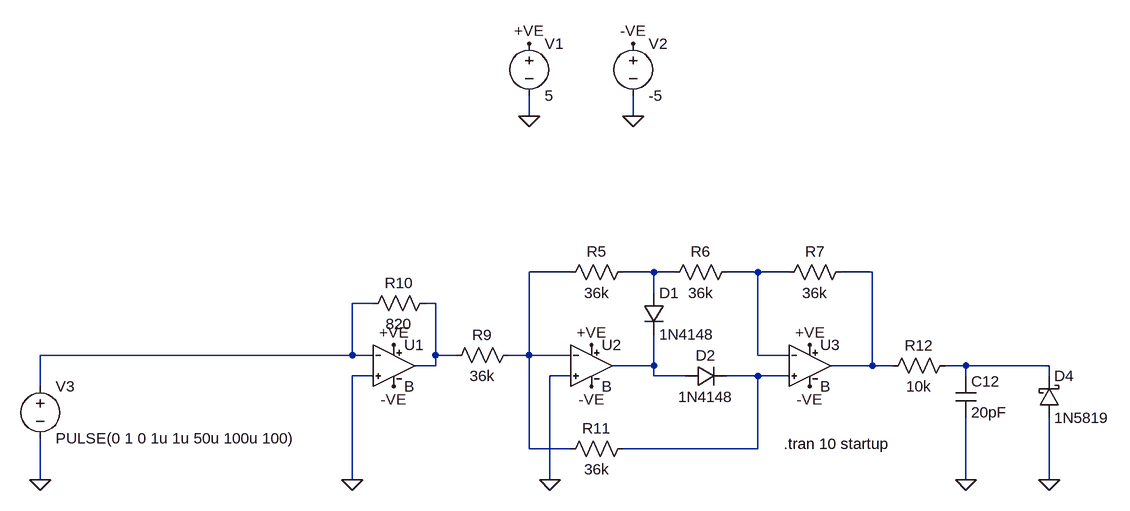
[diagram p0: schematic DFR0300 (V1.0) Test.asc]
DFR0300 (V1.0) Test.asc, the LTspice schematic file:
Version 4
SHEET 1 880 680
WIRE -384 80 -384 48
WIRE -224 80 -224 48
WIRE -320 320 -384 320
WIRE -192 320 -240 320
WIRE -160 320 -192 320
WIRE -32 320 -80 320
WIRE 16 320 -32 320
WIRE 144 320 96 320
WIRE -192 352 -192 320
WIRE -624 368 -656 368
WIRE -528 368 -544 368
WIRE -656 448 -656 368
WIRE -656 448 -1136 448
WIRE -624 448 -656 448
WIRE -528 448 -528 368
WIRE -496 448 -528 448
WIRE -384 448 -384 320
WIRE -384 448 -416 448
WIRE -320 448 -384 448
WIRE -32 448 -32 320
WIRE 16 448 -32 448
WIRE -528 464 -528 448
WIRE -528 464 -560 464
WIRE -192 464 -192 416
WIRE -192 464 -256 464
WIRE 144 464 144 320
WIRE 144 464 80 464
WIRE 176 464 144 464
WIRE 288 464 256 464
WIRE 416 464 288 464
WIRE -624 480 -656 480
WIRE -320 480 -352 480
WIRE -192 480 -192 464
WIRE -144 480 -192 480
WIRE -32 480 -80 480
WIRE 16 480 -32 480
WIRE 288 480 288 464
WIRE 416 480 416 464
WIRE -1136 496 -1136 448
WIRE -384 592 -384 448
WIRE -320 592 -384 592
WIRE -32 592 -32 480
WIRE -32 592 -240 592
WIRE -1136 640 -1136 576
WIRE -656 640 -656 480
WIRE -352 640 -352 480
WIRE 288 640 288 544
WIRE 416 640 416 544
FLAG 416 640 0
FLAG 288 640 0
FLAG -352 640 0
FLAG -656 640 0
FLAG -384 80 0
FLAG -224 80 0
FLAG -384 -32 +VE
FLAG -224 -32 -VE
FLAG -592 432 +VE
FLAG -288 432 +VE
FLAG 48 432 +VE
FLAG -592 496 -VE
FLAG -288 496 -VE
FLAG 48 496 -VE
FLAG -1136 640 0
SYMBOL schottky 400 544 M180
WINDOW 0 24 64 Left 2
WINDOW 3 24 0 Left 2
SYMATTR InstName D4
SYMATTR Value 1N5819
SYMATTR Description Diode
SYMATTR Type diode
SYMBOL Res 272 448 R90
WINDOW 0 0 56 VBottom 2
WINDOW 3 32 56 VTop 2
SYMATTR InstName R12
SYMATTR Value 10k
SYMBOL Cap 272 480 R0
SYMATTR InstName C12
SYMATTR Value 20pF
SYMBOL Res 112 304 R90
WINDOW 0 0 56 VBottom 2
WINDOW 3 32 56 VTop 2
SYMATTR InstName R7
SYMATTR Value 36k
SYMBOL diode -144 496 R270
WINDOW 0 32 32 VTop 2
WINDOW 3 0 32 VBottom 2
SYMATTR InstName D2
SYMATTR Value 1N4148
SYMBOL diode -208 352 R0
SYMATTR InstName D1
SYMATTR Value 1N4148
SYMBOL Res -64 304 R90
WINDOW 0 0 56 VBottom 2
WINDOW 3 32 56 VTop 2
SYMATTR InstName R6
SYMATTR Value 36k
SYMBOL Res -224 304 R90
WINDOW 0 0 56 VBottom 2
WINDOW 3 32 56 VTop 2
SYMATTR InstName R5
SYMATTR Value 36k
SYMBOL Res -224 576 R90
WINDOW 0 0 56 VBottom 2
WINDOW 3 32 56 VTop 2
SYMATTR InstName R11
SYMATTR Value 36k
SYMBOL Res -400 432 R90
WINDOW 0 0 56 VBottom 2
WINDOW 3 32 56 VTop 2
SYMATTR InstName R9
SYMATTR Value 36k
SYMBOL Res -528 352 R90
WINDOW 0 0 56 VBottom 2
WINDOW 3 32 56 VTop 2
SYMATTR InstName R10
SYMATTR Value 820
SYMBOL voltage -384 -48 R0
WINDOW 123 0 0 Left 0
WINDOW 39 0 0 Left 0
SYMATTR InstName V1
SYMATTR Value 5
SYMBOL voltage -224 -48 R0
WINDOW 123 0 0 Left 0
WINDOW 39 0 0 Left 0
SYMATTR InstName V2
SYMATTR Value -5
SYMBOL voltage -1136 480 R0
WINDOW 123 0 0 Left 0
WINDOW 39 0 0 Left 0
SYMATTR InstName V3
SYMATTR Value PULSE(0 1 0 1u 1u 50u 100u 100)
SYMBOL TL034 -592 400 R0
SYMATTR InstName U1
SYMATTR Value B
SYMATTR SpiceModel TL034.mod
SYMBOL TL034 -288 400 R0
SYMATTR InstName U2
SYMATTR Value B
SYMATTR SpiceModel TL034.mod
SYMBOL TL034 48 400 R0
SYMATTR InstName U3
SYMATTR Value B
SYMATTR SpiceModel TL034.mod
TEXT 8 584 Left 2 !.tran 10 startup

The netlist it stands for:
* DFR0300 (V1.0) Test.asc
D4 0 N008 1N5819
R12 N008 N004 10k
C12 N008 0 20pF
R7 N004 N003 36k
D2 N007 N009 1N4148
D1 N002 N007 1N4148
R6 N003 N002 36k
R5 N002 N001 36k
R11 N009 N001 36k
R9 N001 N006 36k
R10 N006 N005 820
V1 +VE 0 5
V2 -VE 0 -5
V3 N005 0 PULSE(0 1 0 1u 1u 50u 100u 100)
XU1 0 N005 +VE -VE N006 B  ; pins In+ In- V+ V- OUT
XU2 0 N001 +VE -VE N007 B  ; pins In+ In- V+ V- OUT
XU3 N009 N003 +VE -VE N004 B  ; pins In+ In- V+ V- OUT
.model D D
.lib standard.dio
.tran 10 startup
.lib TL034.mod
.backanno
.end